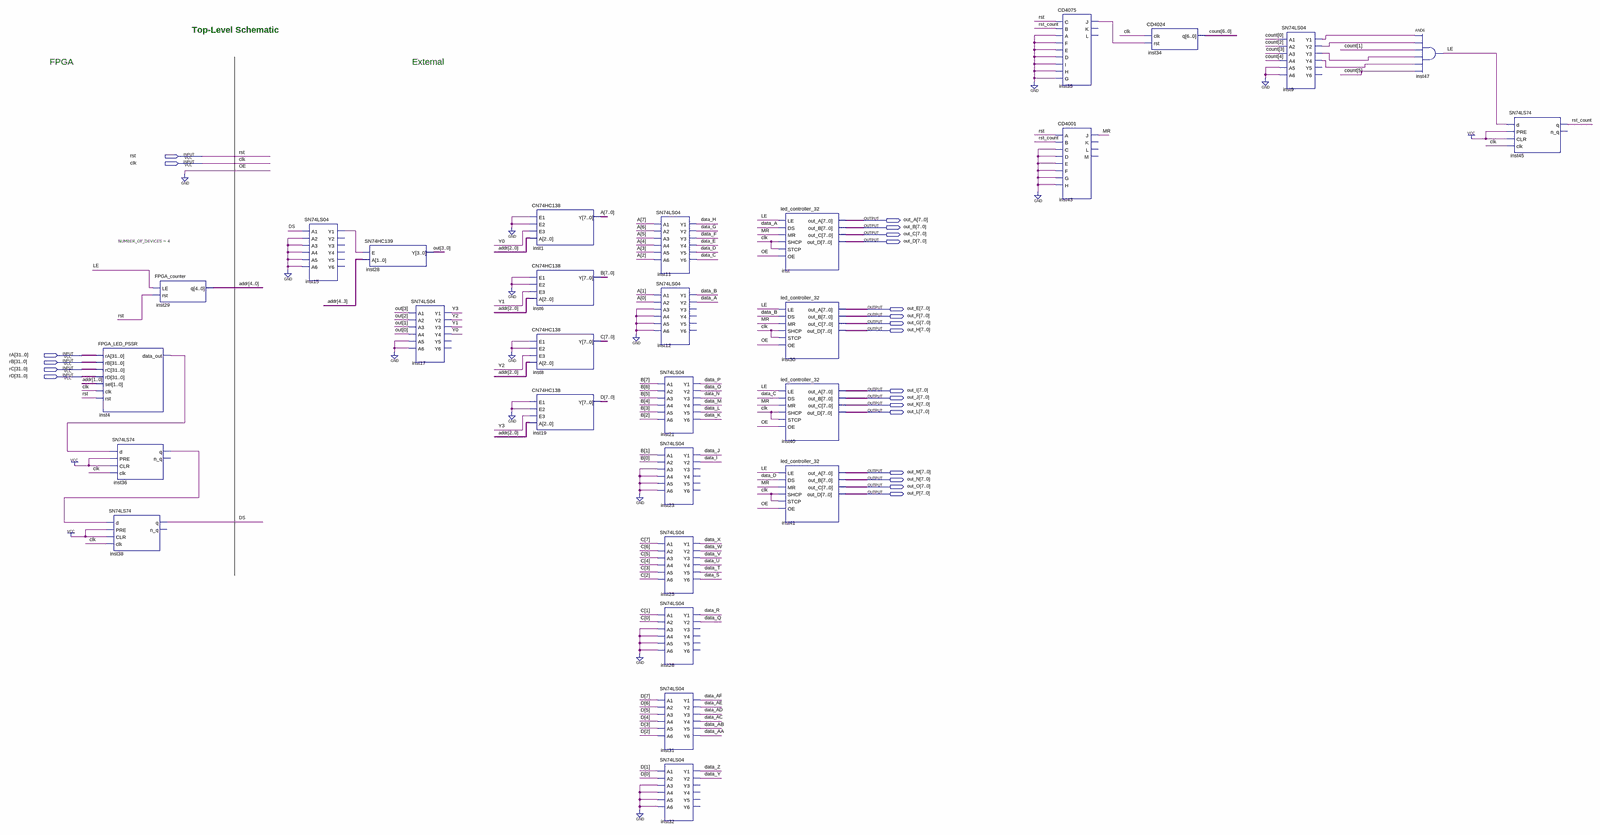
[diagram p0: schematic sheet, whole]
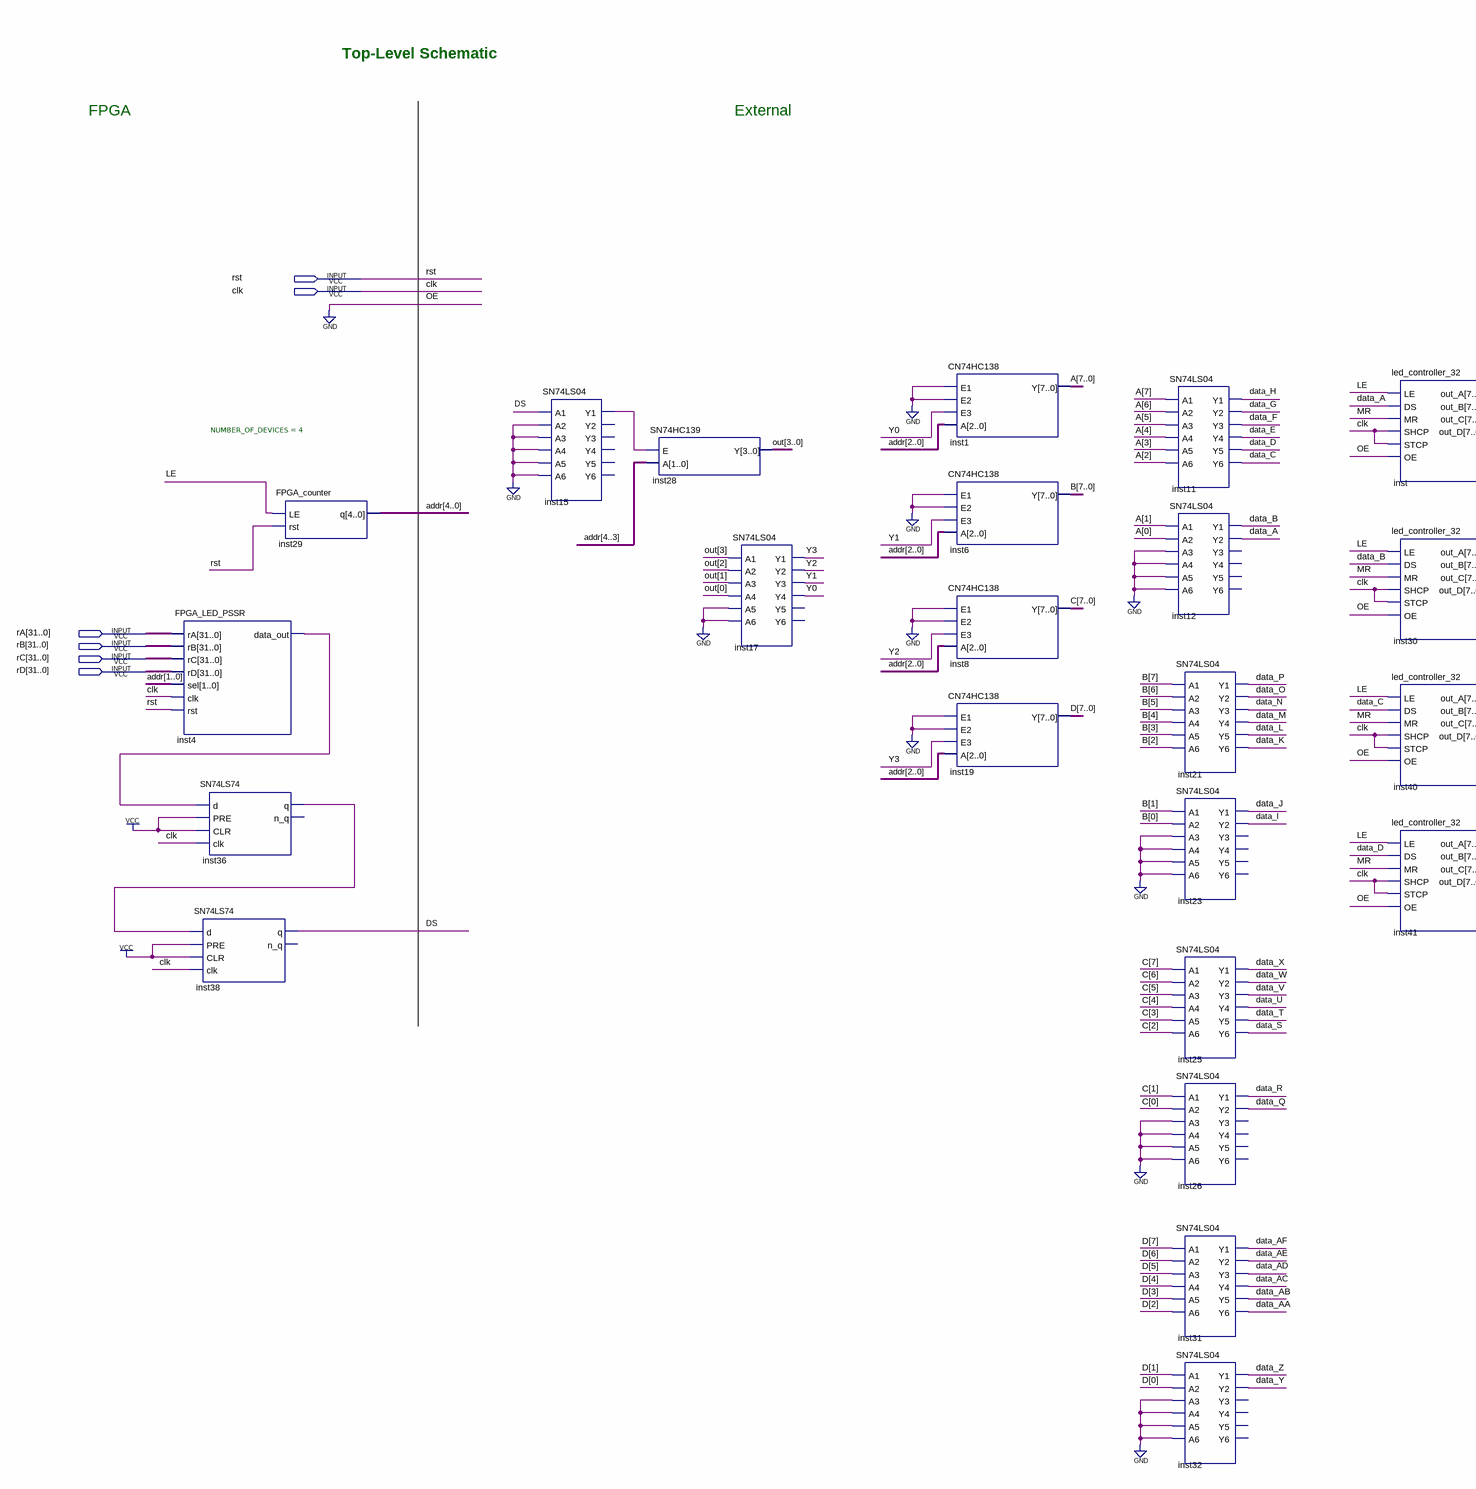
[diagram p1: schematic sheet, left part]
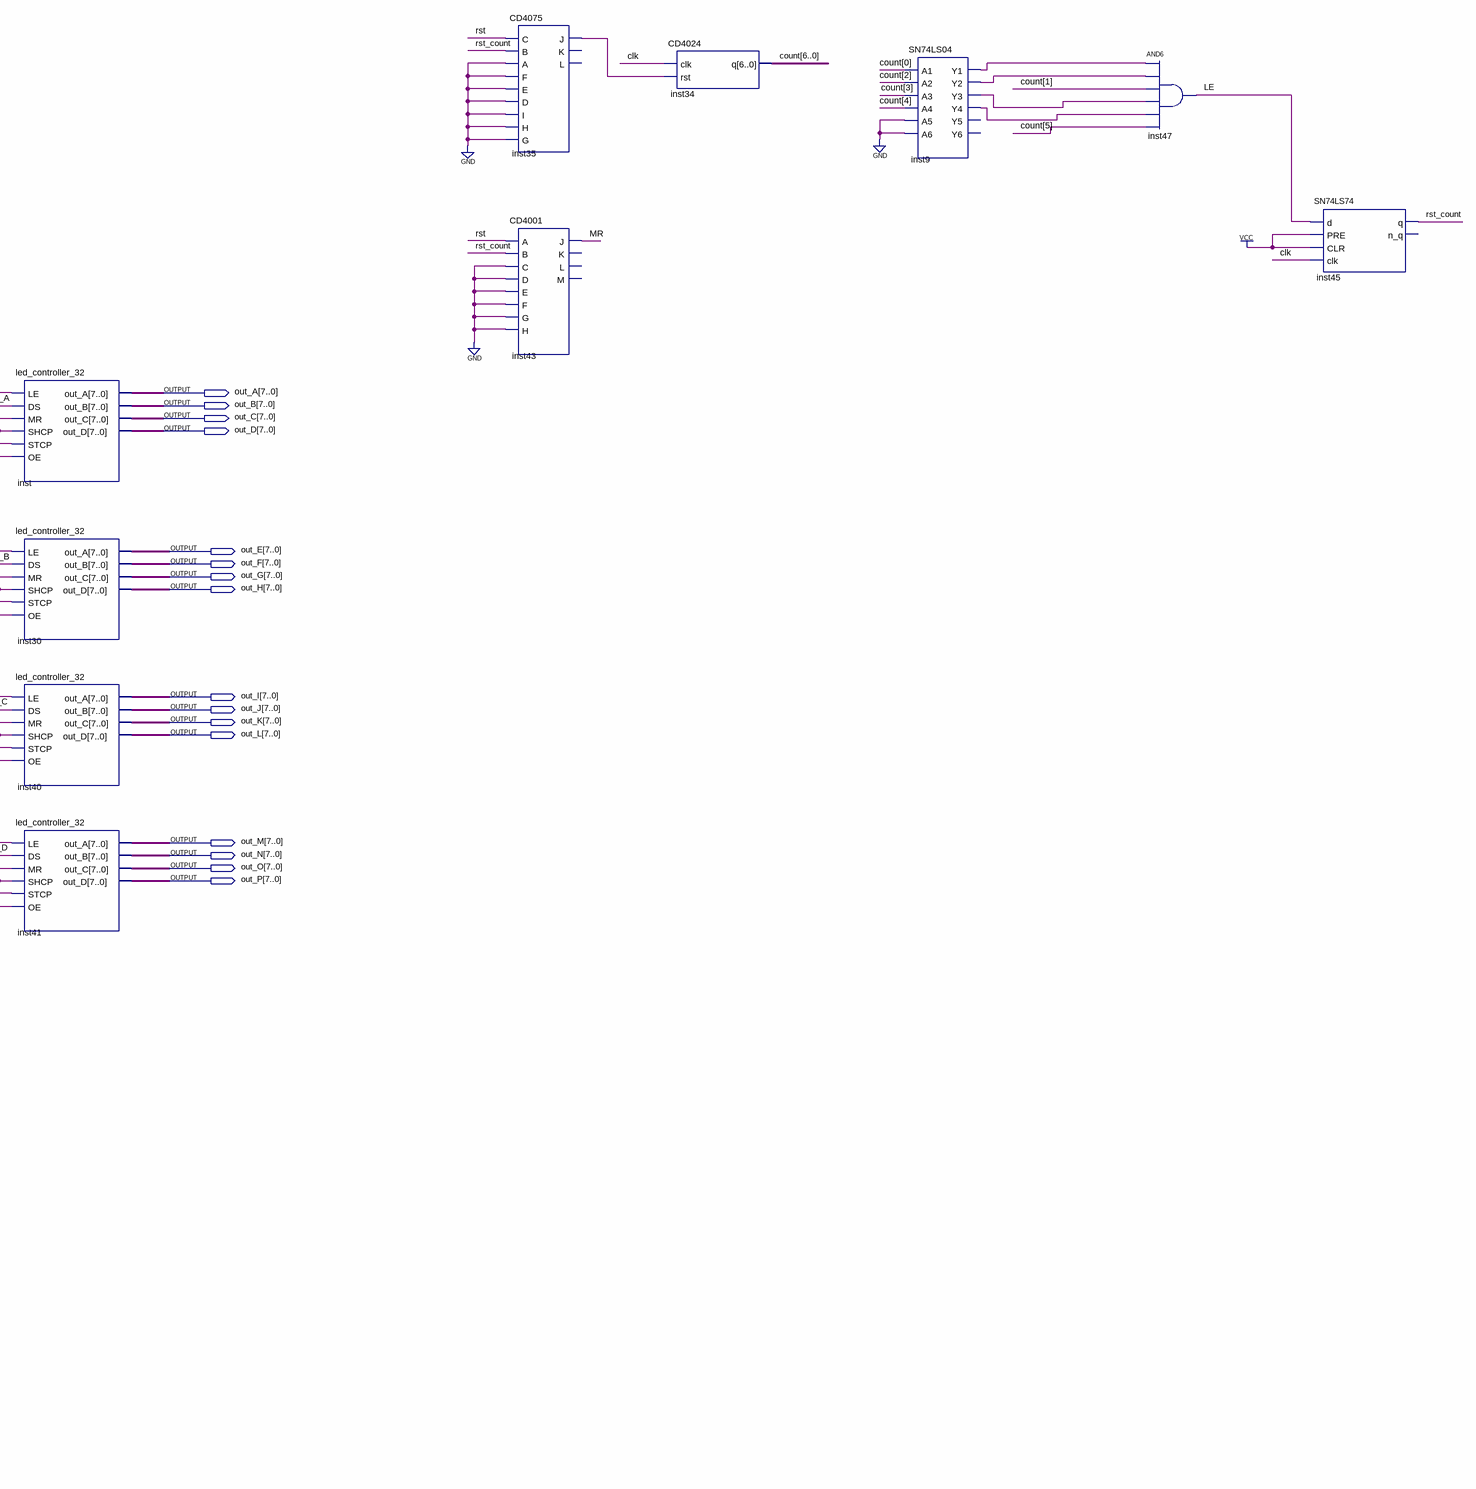
[diagram p2: schematic sheet, right part]
// Quartus schematic TopLevel.bdf as structural Verilog: 29 symbols, 22 pins
module TopLevel (
  input  rst,
  input  clk,
  input  [31:0] rA,
  input  [31:0] rB,
  input  [31:0] rC,
  input  [31:0] rD,
  output [7:0] out_A,
  output [7:0] out_B,
  output [7:0] out_C,
  output [7:0] out_D,
  output [7:0] out_E,
  output [7:0] out_F,
  output [7:0] out_G,
  output [7:0] out_H,
  output [7:0] out_I,
  output [7:0] out_J,
  output [7:0] out_K,
  output [7:0] out_L,
  output [7:0] out_M,
  output [7:0] out_N,
  output [7:0] out_O,
  output [7:0] out_P
);

  wire data_A, data_AA, data_AB, data_AC, data_AD, data_AE, data_AF, data_B, data_C, data_D, data_E, data_F,
       data_G, data_H, data_I, data_J, data_K, data_L, data_M, data_N, data_O, data_P, data_Q, data_R,
       data_S, data_T, data_U, data_V, data_W, data_X, data_Y, data_Z, DS, inst4_data_out, inst9_y1,
       inst9_y2, inst9_y3, inst9_y4, inst15_y1, inst35_j, inst36_q, LE, MR, rst_count, Y0, Y1, Y2, Y3;
  wire [3:0] out;
  wire [4:0] addr;
  wire [6:0] count;
  wire [7:0] A, B, C, D;

  FPGA_LED_PSSR inst4 (
    .rA(rA), .rB(rB), .rC(rC), .rD(rD), .sel(addr[1:0]), .clk(clk), .rst(rst), .data_out(inst4_data_out));
  SN74LS74 inst36 (.d(inst4_data_out), .PRE(1'b1), .CLR(1'b1), .clk(clk), .q(inst36_q));  // open: n_q
  SN74LS74 inst38 (.d(inst36_q), .PRE(1'b1), .CLR(1'b1), .clk(clk), .q(DS));  // open: n_q
  FPGA_counter #(.NUMBER_OF_DEVICES(4)) inst29 (.LE(LE), .rst(rst), .q(addr));
  SN74LS04 inst15 (
    .A1(DS), .A2(1'b0), .A3(1'b0), .A4(1'b0), .A5(1'b0), .A6(1'b0), .Y1(inst15_y1));  // open: Y2, Y3, Y4, Y5, Y6
  SN74HC139 inst28 (.E(inst15_y1), .A(addr[4:3]), .Y(out));
  SN74LS04 inst17 (
    .A1(out[3]), .A2(out[2]), .A3(out[1]), .A4(out[0]), .A5(1'b0), .A6(1'b0), .Y1(Y3), .Y2(Y2), .Y3(Y1),
    .Y4(Y0));  // open: Y5, Y6
  CN74HC138 inst1 (.E1(1'b0), .E2(1'b0), .E3(Y0), .A(addr[2:0]), .Y(A));
  CN74HC138 inst6 (.E1(1'b0), .E2(1'b0), .E3(Y1), .A(addr[2:0]), .Y(B));
  CN74HC138 inst8 (.E1(1'b0), .E2(1'b0), .E3(Y2), .A(addr[2:0]), .Y(C));
  CN74HC138 inst19 (.E1(1'b0), .E2(1'b0), .E3(Y3), .A(addr[2:0]), .Y(D));
  SN74LS04 inst11 (
    .A1(A[7]), .A2(A[6]), .A3(A[5]), .A4(A[4]), .A5(A[3]), .A6(A[2]), .Y1(data_H), .Y2(data_G), .Y3(data_F),
    .Y4(data_E), .Y5(data_D), .Y6(data_C));
  SN74LS04 inst12 (
    .A1(A[1]), .A2(A[0]), .A3(1'b0), .A4(1'b0), .A5(1'b0), .A6(1'b0), .Y1(data_B), .Y2(data_A));  // open: Y3, Y4, Y5, Y6
  SN74LS04 inst21 (
    .A1(B[7]), .A2(B[6]), .A3(B[5]), .A4(B[4]), .A5(B[3]), .A6(B[2]), .Y1(data_P), .Y2(data_O), .Y3(data_N),
    .Y4(data_M), .Y5(data_L), .Y6(data_K));
  SN74LS04 inst23 (
    .A1(B[1]), .A2(B[0]), .A3(1'b0), .A4(1'b0), .A5(1'b0), .A6(1'b0), .Y1(data_J), .Y2(data_I));  // open: Y3, Y4, Y5, Y6
  SN74LS04 inst25 (
    .A1(C[7]), .A2(C[6]), .A3(C[5]), .A4(C[4]), .A5(C[3]), .A6(C[2]), .Y1(data_X), .Y2(data_W), .Y3(data_V),
    .Y4(data_U), .Y5(data_T), .Y6(data_S));
  SN74LS04 inst26 (
    .A1(C[1]), .A2(C[0]), .A3(1'b0), .A4(1'b0), .A5(1'b0), .A6(1'b0), .Y1(data_R), .Y2(data_Q));  // open: Y3, Y4, Y5, Y6
  SN74LS04 inst31 (
    .A1(D[7]), .A2(D[6]), .A3(D[5]), .A4(D[4]), .A5(D[3]), .A6(D[2]), .Y1(data_AF), .Y2(data_AE),
    .Y3(data_AD), .Y4(data_AC), .Y5(data_AB), .Y6(data_AA));
  SN74LS04 inst32 (
    .A1(D[1]), .A2(D[0]), .A3(1'b0), .A4(1'b0), .A5(1'b0), .A6(1'b0), .Y1(data_Z), .Y2(data_Y));  // open: Y3, Y4, Y5, Y6
  led_controller_32 inst (
    .LE(LE), .DS(data_A), .MR(MR), .SHCP(clk), .STCP(clk), .OE(1'b0), .out_A(out_A), .out_B(out_B),
    .out_C(out_C), .out_D(out_D));
  led_controller_32 inst30 (
    .LE(LE), .DS(data_B), .MR(MR), .SHCP(clk), .STCP(clk), .OE(1'b0), .out_A(out_E), .out_B(out_F),
    .out_C(out_G), .out_D(out_H));
  led_controller_32 inst40 (
    .LE(LE), .DS(data_C), .MR(MR), .SHCP(clk), .STCP(clk), .OE(1'b0), .out_A(out_I), .out_B(out_J),
    .out_C(out_K), .out_D(out_L));
  led_controller_32 inst41 (
    .LE(LE), .DS(data_D), .MR(MR), .SHCP(clk), .STCP(clk), .OE(1'b0), .out_A(out_M), .out_B(out_N),
    .out_C(out_O), .out_D(out_P));
  CD4075 inst35 (
    .C(rst), .B(rst_count), .A(1'b0), .F(1'b0), .E(1'b0), .D(1'b0), .I(1'b0), .H(1'b0), .G(1'b0), .J(inst35_j));  // open: K, L
  CD4001 inst43 (
    .A(rst), .B(rst_count), .C(1'b0), .D(1'b0), .E(1'b0), .F(1'b0), .G(1'b0), .H(1'b0), .J(MR));  // open: K, L, M
  CD4024 inst34 (.clk(clk), .rst(inst35_j), .q(count));
  SN74LS04 inst9 (
    .A1(count[0]), .A2(count[2]), .A3(count[3]), .A4(count[4]), .A5(1'b0), .A6(1'b0), .Y1(inst9_y1),
    .Y2(inst9_y2), .Y3(inst9_y3), .Y4(inst9_y4));  // open: Y5, Y6
  and inst47 (LE, inst9_y1, inst9_y2, count[1], inst9_y3, inst9_y4, count[5]);
  SN74LS74 inst45 (.d(LE), .PRE(1'b1), .CLR(1'b1), .clk(clk), .q(rst_count));  // open: n_q

  // Notes on the sheet:
  //   Top-Level Schematic
  //   FPGA
  //   External
endmodule
